# EAGLE design BUTTON BREAKOUT (EAGLE 6.3)
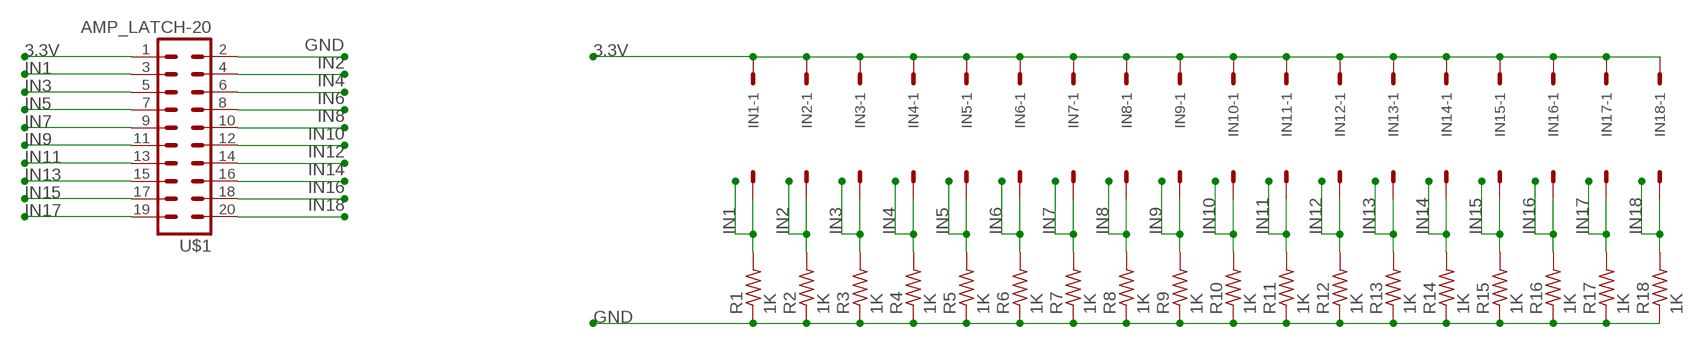
[diagram p0: schematic, sheet 1]

## Parts
IN1  C-GRID-02-70543  [70543-02]
IN2  C-GRID-02-70543  [70543-02]
IN3  C-GRID-02-70543  [70543-02]
IN4  C-GRID-02-70543  [70543-02]
IN5  C-GRID-02-70543  [70543-02]
IN6  C-GRID-02-70543  [70543-02]
IN7  C-GRID-02-70543  [70543-02]
IN8  C-GRID-02-70543  [70543-02]
IN9  C-GRID-02-70543  [70543-02]
IN10  C-GRID-02-70543  [70543-02]
IN11  C-GRID-02-70543  [70543-02]
IN12  C-GRID-02-70543  [70543-02]
IN13  C-GRID-02-70543  [70543-02]
IN14  C-GRID-02-70543  [70543-02]
IN15  C-GRID-02-70543  [70543-02]
IN16  C-GRID-02-70543  [70543-02]
IN17  C-GRID-02-70543  [70543-02]
IN18  C-GRID-02-70543  [70543-02]
R1  1K  R-US_R1206  [R1206]
R2  1K  R-US_R1206  [R1206]
R3  1K  R-US_R1206  [R1206]
R4  1K  R-US_R1206  [R1206]
R5  1K  R-US_R1206  [R1206]
R6  1K  R-US_R1206  [R1206]
R7  1K  R-US_R1206  [R1206]
R8  1K  R-US_R1206  [R1206]
R9  1K  R-US_R1206  [R1206]
R10  1K  R-US_R1206  [R1206]
R11  1K  R-US_R1206  [R1206]
R12  1K  R-US_R1206  [R1206]
R13  1K  R-US_R1206  [R1206]
R14  1K  R-US_R1206  [R1206]
R15  1K  R-US_R1206  [R1206]
R16  1K  R-US_R1206  [R1206]
R17  1K  R-US_R1206  [R1206]
R18  1K  R-US_R1206  [R1206]
U$1  AMP_LATCH-20  [MA10-2]

## Nets
3.3V: IN1.1 IN2.1 IN3.1 IN4.1 IN5.1 IN6.1 IN7.1 IN8.1 IN9.1 IN10.1 IN11.1 IN12.1 IN13.1 IN14.1 IN15.1 IN16.1 IN17.1 IN18.1 U$1.1
GND: R1.1 R2.1 R3.1 R4.1 R5.1 R6.1 R7.1 R8.1 R9.1 R10.1 R11.1 R12.1 R13.1 R14.1 R15.1 R16.1 R17.1 R18.1 U$1.2
IN1: IN1.2 R1.2 U$1.3
IN2: IN2.2 R2.2 U$1.4
IN3: IN3.2 R3.2 U$1.5
IN4: IN4.2 R4.2 U$1.6
IN5: IN5.2 R5.2 U$1.7
IN6: IN6.2 R6.2 U$1.8
IN7: IN7.2 R7.2 U$1.9
IN8: IN8.2 R8.2 U$1.10
IN9: IN9.2 R9.2 U$1.11
IN10: IN10.2 R10.2 U$1.12
IN11: IN11.2 R11.2 U$1.13
IN12: IN12.2 R12.2 U$1.14
IN13: IN13.2 R13.2 U$1.15
IN14: IN14.2 R14.2 U$1.16
IN15: IN15.2 R15.2 U$1.17
IN16: IN16.2 R16.2 U$1.18
IN17: IN17.2 R17.2 U$1.19
IN18: IN18.2 R18.2 U$1.20

## Library data of the parts
IN1-IN18 = con-molex:C-GRID-02: CONNECTOR wire to board 2.54 mm (0.100") pitch header; OC_FARNELL: unknown; OC_NEWARK: unknown
R1-R18 = rcl:R-US_: RESISTOR, American symbol
U$1 = SolarJackets_Common:AMP_LATCH-20; PART_NUM: 5499160-1

## Board
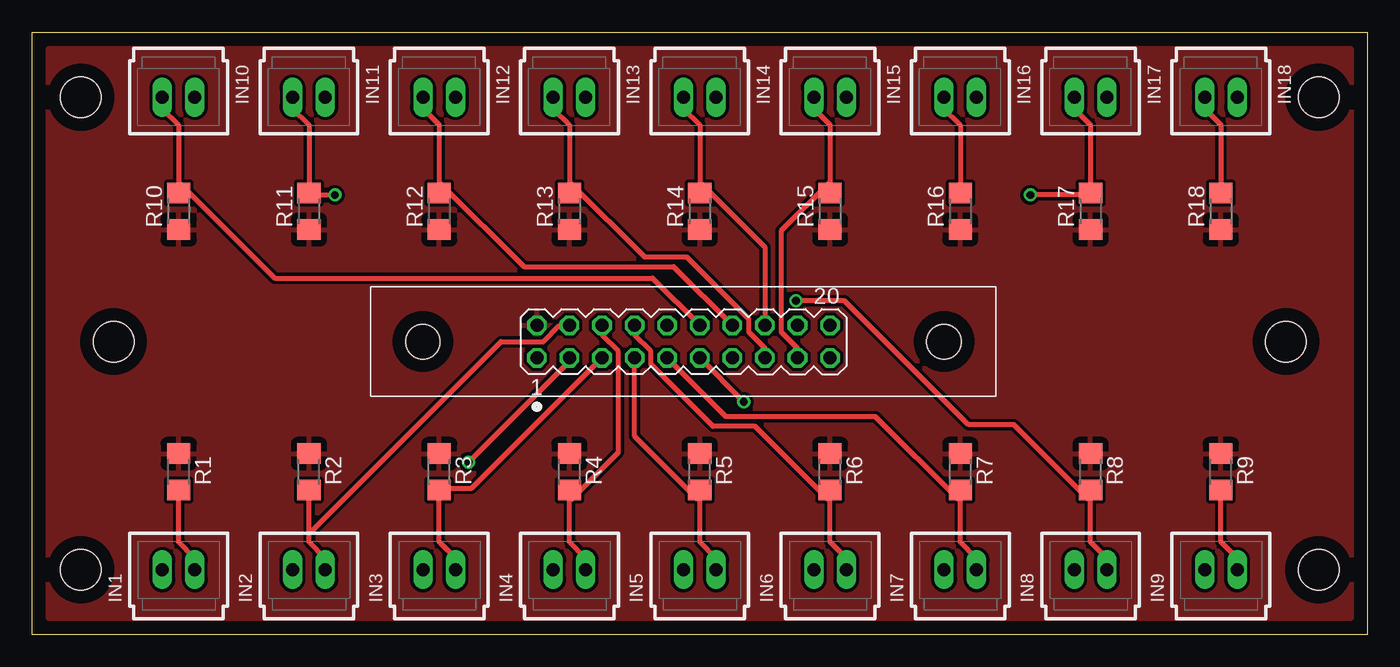
[diagram p1: board, top side]
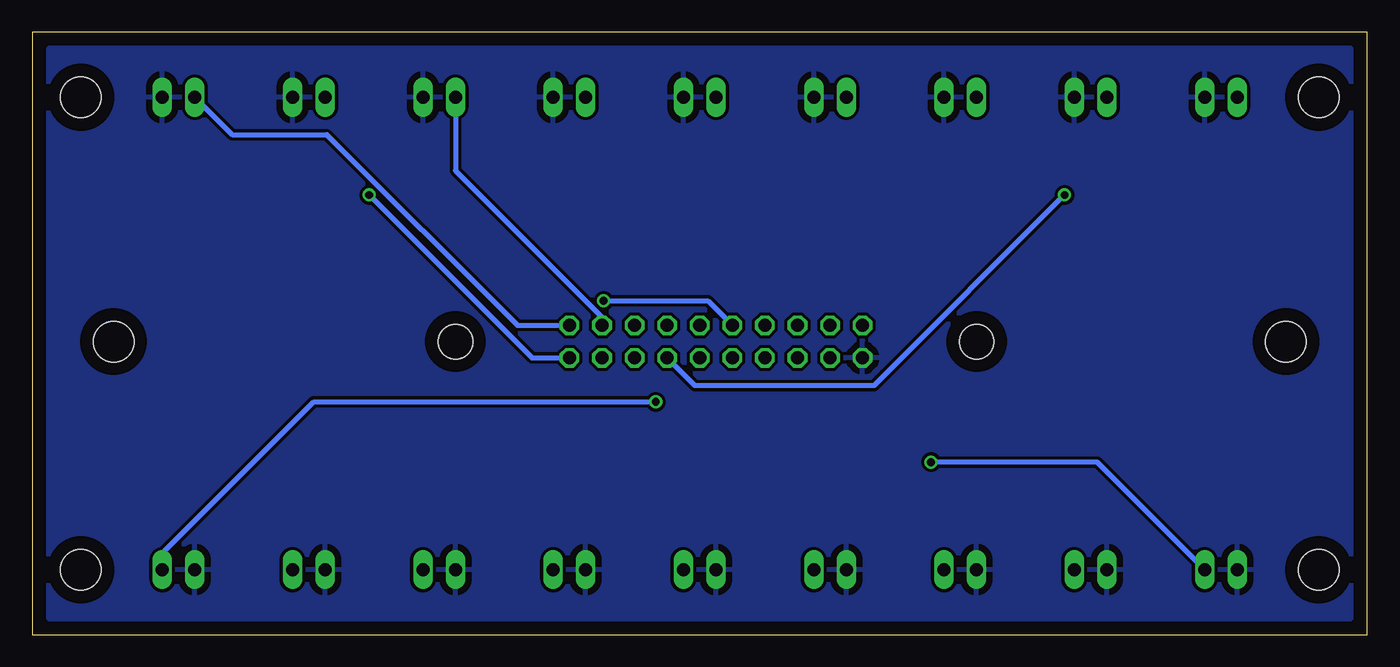
[diagram p2: board, bottom side, seen from below]

Size 104.14 x 46.99 mm. Coordinates in mm from the lower left corner, seen from the top.
Outline: 104.14,0 0,0 0,46.99 104.14,46.99 104.14,0
Copper layers (1*16): Top 0.035mm / dielectric 1.5mm / Bottom 0.035mm
Design rules "SJ Design Rules": minimum track width 16mil, minimum drill 24mil, track to track 10mil, track to pad 10mil, pad to pad 10mil, via to via 10mil, smd to smd 10mil, copper to edge 40mil, drill to drill 10mil, minimum pad ring 10mil, minimum via ring 8mil, stop-mask expansion 4mil, vias tented up to drill 0mil, thermal gap 20mil
Holes 3.17 mm at 100.33,5.08 100.33,41.91 3.81,5.08 3.81,41.91 6.35,22.86 97.79,22.86

### Footprints (pad centres in the part's own frame; a part is rotated, then mirrored left to right if it is on the bottom)
70543-02 = drill 1.016 long: 1 -1.27,0; 2 1.27,0
R1206 = smd 1.6 x 1.803: 1 -1.422,0; 2 1.422,0
MA10-2 = drill 1.016 octagon: 1 -11.43,-1.27; 2 -11.43,1.27; 3 -8.89,-1.27; 4 -8.89,1.27; 5 -6.35,-1.27; 6 -6.35,1.27; 7 -3.81,-1.27; 8 -3.81,1.27; 9 -1.27,-1.27; 10 -1.27,1.27; 11 1.27,-1.27; 12 1.27,1.27; 13 3.81,-1.27; 14 3.81,1.27; 15 6.35,-1.27; 16 6.35,1.27; 17 8.89,-1.27; 18 8.89,1.27; 19 11.43,-1.27; 20 11.43,1.27 | hole 2.692: -20.32,0; 20.32,0

### Placement (x,y rotation side)
IN1  11.43,5.08 0 top
IN2  21.59,5.08 0 top
IN3  31.75,5.08 0 top
IN4  41.91,5.08 0 top
IN5  52.07,5.08 0 top
IN6  62.23,5.08 0 top
IN7  72.39,5.08 0 top
IN8  82.55,5.08 0 top
IN9  92.71,5.08 0 top
IN10  11.43,41.91 180 top
IN11  21.59,41.91 180 top
IN12  31.75,41.91 180 top
IN13  41.91,41.91 180 top
IN14  52.07,41.91 180 top
IN15  62.23,41.91 180 top
IN16  72.39,41.91 180 top
IN17  82.55,41.91 180 top
IN18  92.71,41.91 180 top
R1  11.43,12.7 270 top
R2  21.59,12.7 270 top
R3  31.75,12.7 270 top
R4  41.91,12.7 270 top
R5  52.07,12.7 270 top
R6  62.23,12.7 270 top
R7  72.39,12.7 270 top
R8  82.55,12.7 270 top
R9  92.71,12.7 270 top
R10  11.43,33.02 90 top
R11  21.59,33.02 90 top
R12  31.75,33.02 90 top
R13  41.91,33.02 90 top
R14  52.07,33.02 90 top
R15  62.23,33.02 90 top
R16  72.39,33.02 90 top
R17  82.55,33.02 90 top
R18  92.71,33.02 90 top
U$1  50.8,22.86 0 top

### Tracks (layer width: path | path; a pad name or v marks a point on that pad's centre or on a via)
3.3V
  pour Bottom: 1.27,1.27 1.27,45.72 102.87,45.72 102.87,1.27
GND
  pour Top: 1.27,1.27 1.27,45.72 102.87,45.72 102.87,1.27
IN1  (via drill 0.61)
  Top 0.406: R1.2 11.43,7.24 12.7,5.97 IN1.2 | U$1.3 41.91,21.34 v34.04,13.46
  Bottom 0.406: v34.04,13.46 21.08,13.46 IN1.2
IN2
  Top 0.406: 21.59,8 21.59,7.24 22.86,5.97 IN2.2 | 21.59,8 R2.2 | U$1.4 41.15,24.13 39.88,22.86 36.58,22.86 21.72,8 21.59,8
IN3
  Top 0.406: IN3.2 33.02,5.97 31.75,7.24 R3.2 31.88,11.43 34.29,11.43 U$1.5
IN4
  Top 0.406: IN4.2 43.18,5.97 41.91,7.24 R4.2 42.04,10.54 45.72,14.22 45.72,22.1 44.45,23.37 U$1.6
IN5
  Top 0.406: IN5.2 53.34,5.97 52.07,7.24 R5.2 51.94,10.54 46.99,15.49 U$1.7
IN6
  Top 0.406: IN6.2 63.5,5.97 62.23,7.24 R6.2 62.1,10.54 56.39,16.26 53.09,16.26 48.26,21.08 48.26,22.1 46.99,23.37 U$1.8
IN7
  Top 0.406: IN7.2 73.66,5.97 72.39,7.24 R7.2 72.26,10.54 65.79,17.02 54.1,17.02 U$1.9
IN8  (via drill 0.61)
  Top 0.406: IN8.2 83.82,5.97 82.55,7.24 R8.2 82.42,10.54 76.58,16.38 73.03,16.38 63.37,26.04 v59.56,26.04
  Bottom 0.406: U$1.10 51.44,26.04 v59.56,26.04
IN9  (via drill 0.61)
  Top 0.406: R9.2 92.71,7.24 93.98,5.97 IN9.2 | v55.5,18.16 U$1.11
  Bottom 0.406: v55.5,18.16 82.17,18.16 93.98,6.35 IN9.2
IN10
  Top 0.406: IN10.2 10.16,41.02 11.43,39.75 R10.2 11.56,35.18 18.92,27.81 48.39,27.81 U$1.12
IN11  (via drill 0.61)
  Top 0.406: IN11.2 20.32,41.02 21.59,39.75 R11.2 21.72,34.29 v23.62,34.29
  Bottom 0.406: U$1.13 52.45,19.43 38.48,19.43 v23.62,34.29
IN12
  Top 0.406: IN12.2 30.48,41.02 31.75,39.75 R12.2 31.88,35.18 38.35,28.7 50.04,28.7 U$1.14
IN13
  Top 0.406: IN13.2 40.64,41.02 41.91,39.75 R13.2 42.04,35.18 47.75,29.46 51.05,29.46 55.88,24.64 55.88,23.62 57.15,22.35 U$1.15
IN14
  Top 0.406: IN14.2 50.8,41.02 52.07,39.75 R14.2 52.2,35.18 57.15,30.23 U$1.16
IN15
  Top 0.406: IN15.2 60.96,41.02 62.23,39.75 R15.2 62.1,35.18 58.42,31.5 58.42,23.62 59.69,22.35 U$1.17
IN16
  Top 0.406: R16.2 72.39,39.75 71.12,41.02 IN16.2
  Bottom 0.406: U$1.18 59.69,24.77 71.12,36.2 IN16.2
IN17  (via drill 0.61)
  Top 0.406: IN17.2 81.28,41.02 82.55,39.75 R17.2 82.42,34.29 v77.85,34.29
  Bottom 0.406: U$1.19 65.15,21.59 v77.85,34.29
IN18
  Top 0.406: R18.2 92.71,39.75 91.44,41.02 IN18.2
  Bottom 0.406: U$1.20 66.29,24.13 81.15,38.99 88.52,38.99 IN18.2

### Text on the board
tValues: 1: 3.3v / 2: GND / 3-20: IN1-18 | SOLAR JACKETS / BUTTON BOARD / 2/27/13 REV 1